# EAGLE design power PCB (EAGLE 7.1.0)
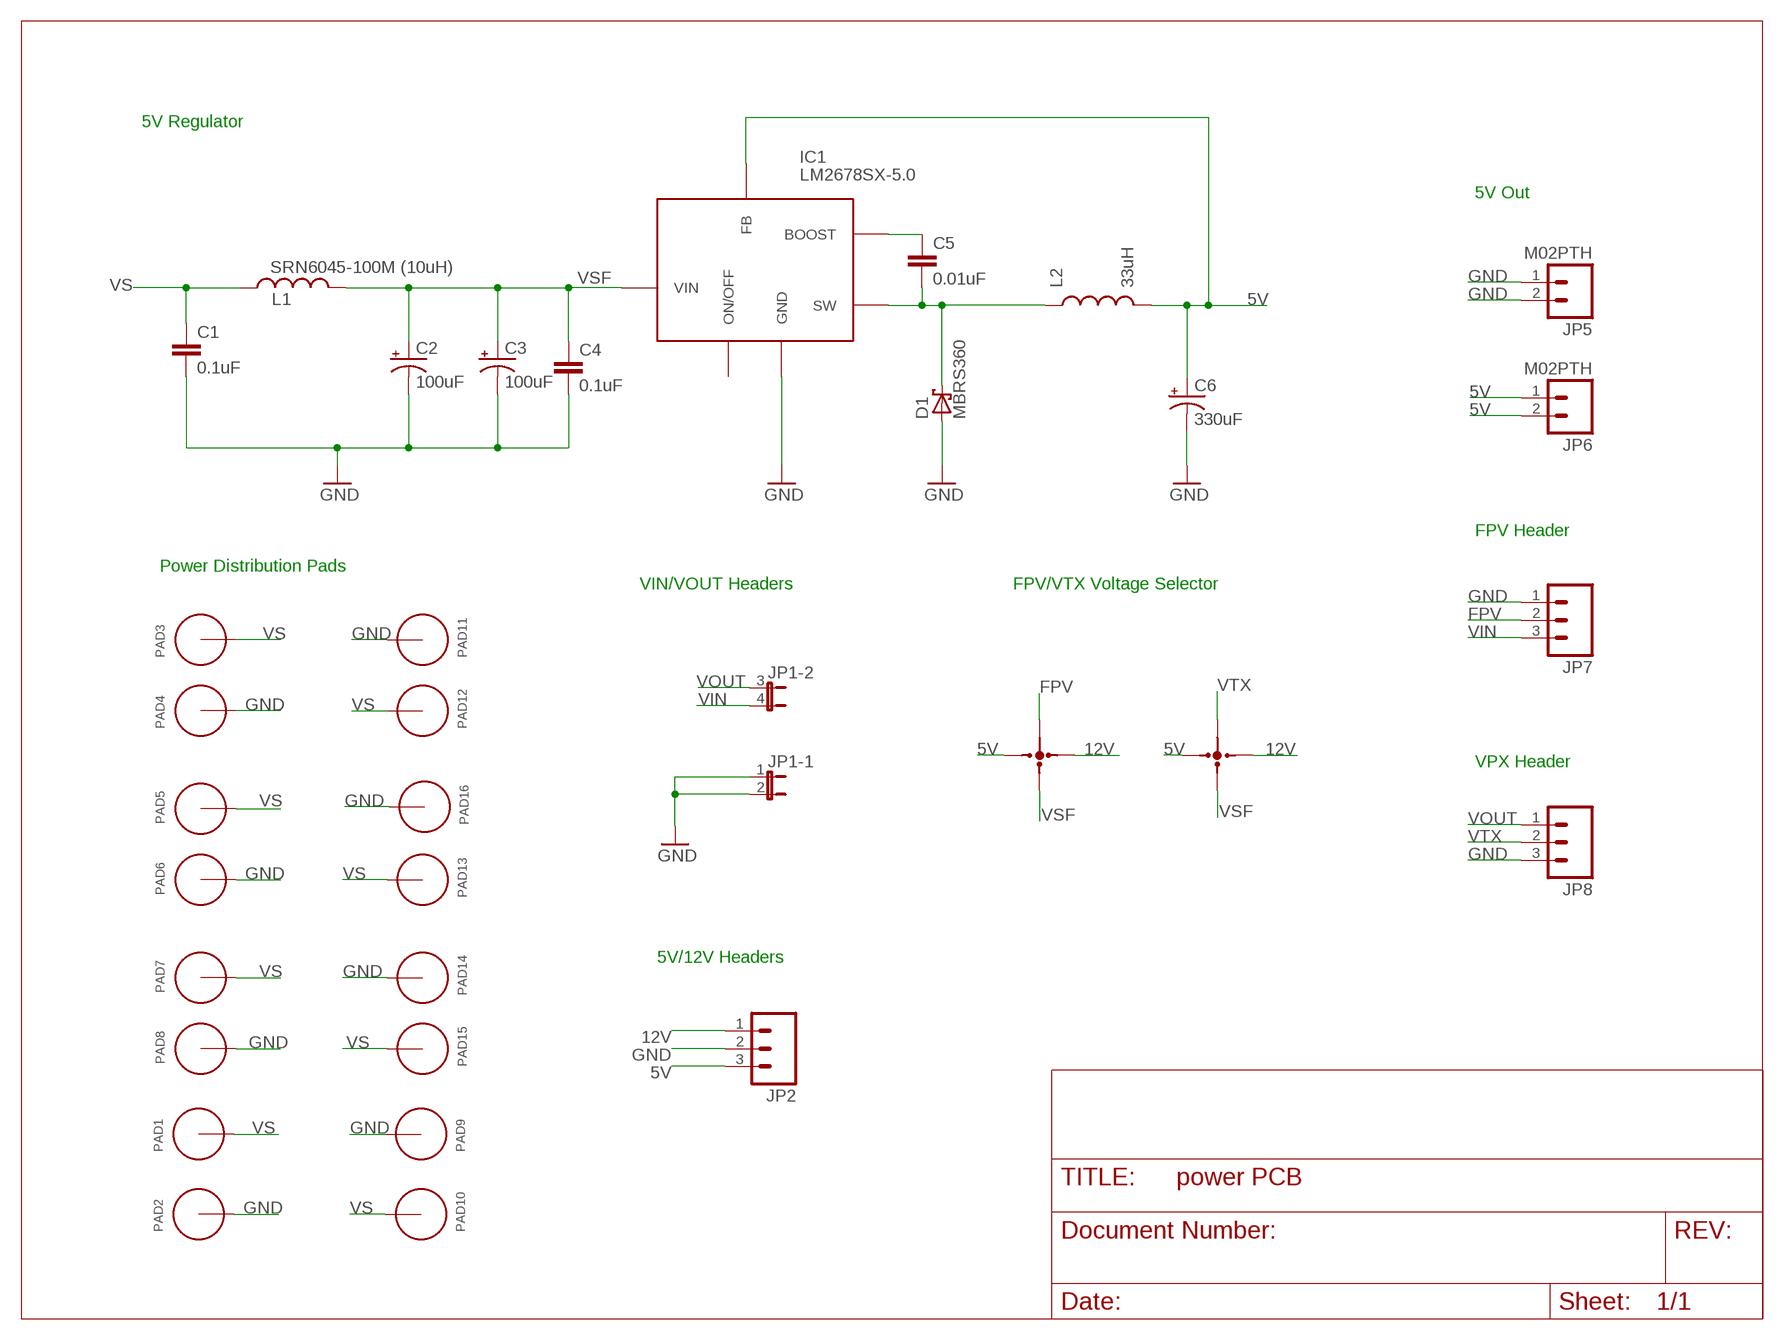
[diagram p0: schematic, sheet 1]

## Parts
C1  0.1uF  0.1UF-25V(+80/-20%)(0603)  [0603-CAP]
C2  100uF  100UF-10V-10%(TANT)  [EIA7343]
C3  100uF  100UF-10V-10%(TANT)  [EIA7343]
C4  0.1uF  0.1UF-25V(+80/-20%)(0603)  [0603-CAP]
C5  0.01uF  0.1UF-25V(+80/-20%)(0603)  [0603-CAP]
C6  330uF  100UF-10V-10%(TANT)  [EIA7343]
D1  MBRS360  MBRS130LT3  [SMB]
IC1  LM2678SX-5.0  LM2678DX-5.0SX-5.0  [P-TO263-7-1]
JP1  JP2QE  [JP2Q]
JP2  M03PTH  [1X03]
JP3  3WAY_SMD_JUMPER  [3WAY_JUMPER]
JP4  3WAY_SMD_JUMPER  [3WAY_JUMPER]
JP5  M02PTH  [1X02]
JP6  M02PTH  [1X02]
JP7  M03PTH  [1X03]
JP8  M03PTH  [1X03]
L1  SRN6045-100M (10uH)  INDUCTORBOURNS_SRN6045  [SRN6045]
L2  33uH  INDUCTORBOURNS_SRN6045  [SRN6045]
PAD1  PAD_3MM  [PAD_3MM]
PAD2  PAD_3MM  [PAD_3MM]
PAD3  PAD_3MM  [PAD_3MM]
PAD4  PAD_3MM  [PAD_3MM]
PAD5  PAD_3MM  [PAD_3MM]
PAD6  PAD_3MM  [PAD_3MM]
PAD7  PAD_3MM  [PAD_3MM]
PAD8  PAD_3MM  [PAD_3MM]
PAD9  PAD_3MM  [PAD_3MM]
PAD10  PAD_3MM  [PAD_3MM]
PAD11  PAD_3MM  [PAD_3MM]
PAD12  PAD_3MM  [PAD_3MM]
PAD13  PAD_3MM  [PAD_3MM]
PAD14  PAD_3MM  [PAD_3MM]
PAD15  PAD_3MM  [PAD_3MM]
PAD16  PAD_3MM  [PAD_3MM]

## Nets
5V: C6.A(+) IC1.6(FB) JP2.3 JP3.1 JP4.3 JP6.1 JP6.2 L2.2
12V: JP2.1 JP3.3 JP4.1
FPV: JP3.4 JP7.2
GND: C1.2 C2.C(-) C3.C(-) C4.2 C6.C(-) D1.A IC1.4(GND) IC1.TH(GND) JP1.1 JP1.2 JP2.2 JP5.1 JP5.2 JP7.1 JP8.3 PAD2.P$1 PAD2.P$2 PAD2.P$3 PAD2.P$4 PAD2.P$5 PAD2.P$6 PAD2.P$7 PAD2.P$8 PAD2.P$9 PAD4.P$1 PAD4.P$2 PAD4.P$3 PAD4.P$4 PAD4.P$5 PAD4.P$6 PAD4.P$7 PAD4.P$8 PAD4.P$9 PAD6.P$1 PAD6.P$2 PAD6.P$3 PAD6.P$4 PAD6.P$5 PAD6.P$6 PAD6.P$7 PAD6.P$8 PAD6.P$9 PAD8.P$1 PAD8.P$2 PAD8.P$3 PAD8.P$4 PAD8.P$5 PAD8.P$6 PAD8.P$7 PAD8.P$8 PAD8.P$9 PAD9.P$1 PAD9.P$2 PAD9.P$3 PAD9.P$4 PAD9.P$5 PAD9.P$6 PAD9.P$7 PAD9.P$8 PAD9.P$9 PAD11.P$1 PAD11.P$2 PAD11.P$3 PAD11.P$4 PAD11.P$5 PAD11.P$6 PAD11.P$7 PAD11.P$8 PAD11.P$9 PAD14.P$1 PAD14.P$2 PAD14.P$3 PAD14.P$4 PAD14.P$5 PAD14.P$6 PAD14.P$7 PAD14.P$8 PAD14.P$9 PAD16.P$1 PAD16.P$2 PAD16.P$3 PAD16.P$4 PAD16.P$5 PAD16.P$6 PAD16.P$7 PAD16.P$8 PAD16.P$9
N$1: C5.1 IC1.3(BOOST)
N$3: C5.2 D1.C IC1.1(SW) L2.1
VIN: JP1.4 JP7.3
VOUT: JP1.3 JP8.1
VS: C1.1 L1.1 PAD1.P$1 PAD1.P$2 PAD1.P$3 PAD1.P$4 PAD1.P$5 PAD1.P$6 PAD1.P$7 PAD1.P$8 PAD1.P$9 PAD3.P$1 PAD3.P$2 PAD3.P$3 PAD3.P$4 PAD3.P$5 PAD3.P$6 PAD3.P$7 PAD3.P$8 PAD3.P$9 PAD5.P$1 PAD5.P$2 PAD5.P$3 PAD5.P$4 PAD5.P$5 PAD5.P$6 PAD5.P$7 PAD5.P$8 PAD5.P$9 PAD7.P$1 PAD7.P$2 PAD7.P$3 PAD7.P$4 PAD7.P$5 PAD7.P$6 PAD7.P$7 PAD7.P$8 PAD7.P$9 PAD10.P$1 PAD10.P$2 PAD10.P$3 PAD10.P$4 PAD10.P$5 PAD10.P$6 PAD10.P$7 PAD10.P$8 PAD10.P$9 PAD12.P$1 PAD12.P$2 PAD12.P$3 PAD12.P$4 PAD12.P$5 PAD12.P$6 PAD12.P$7 PAD12.P$8 PAD12.P$9 PAD13.P$1 PAD13.P$2 PAD13.P$3 PAD13.P$4 PAD13.P$5 PAD13.P$6 PAD13.P$7 PAD13.P$8 PAD13.P$9 PAD15.P$1 PAD15.P$2 PAD15.P$3 PAD15.P$4 PAD15.P$5 PAD15.P$6 PAD15.P$7 PAD15.P$8 PAD15.P$9
VSF: C2.A(+) C3.A(+) C4.1 IC1.2(VIN) JP3.2 JP4.2 L1.2
VTX: JP4.4 JP8.2
Unconnected: IC1.7(ON/OFF)

## Notes on the sheet
- 5V Regulator
- 5V Out
- FPV Header
- Power Distribution Pads
- VIN/VOUT Headers | FPV/VTX Voltage Selector
- VPX Header
- 5V/12V Headers

## Library data of the parts
C1 C4 = SparkFun-Capacitors:0.1UF-25V(+80/-20%)(0603): CAP-00810 Ceramic Standard decoupling cap; PROD_ID: CAP-00810
C2 C3 = Power PCB:100UF-10V-10%(TANT): CAP-07890; PROD_ID: TPSD107K020R0100
C5 = SparkFun-Capacitors:0.1UF-25V(+80/-20%)(0603): CAP-00810 Ceramic Standard decoupling cap; PROD_ID: CAP-00810; VALUE: 0.1uF
C6 = SparkFun-Capacitors:100UF-10V-10%(TANT): CAP-07890; PROD_ID: CAP-07890; VALUE: 100uF
D1 = diode:MBRS130LT3: Schottky Power Rectifier Source: http://www.onsemi.com/pub/Collateral/MBRS130LT3-D.PDF
IC1 = Power PCB:LM2678DX-5.0
JP1 = jumper:JP2QE: JUMPER
JP2 JP7 JP8 = SparkFun-Connectors:M03: Header 3 Standard 3-pin 0.1" header. Use with straight break away headers (SKU : PRT-00116), right angle break away headers (PRT-00553), swiss pins (PRT-00743), machine pins (PRT-00117), and female headers (PRT-00115). Molex polarized connector foot print use with SKU : PRT-08232 with associated crimp pins and housings.
JP3 JP4 = Power PCB:3WAY_SMD_JUMPER
JP5 JP6 = SparkFun-Connectors:M02: Standard 2-pin 0.1" header. Use with - straight break away headers ( PRT-00116) - right angle break away headers (PRT-00553) - swiss pins (PRT-00743) - machine pins (PRT-00117) - female headers (PRT-00115) Molex polarized connector foot print use with: PRT-08233 with associated crimp pins and housings. 2.54_SCREWTERM for use with PRT-10571. 3.5mm Screw Terminal footprints for PRT-08084 5mm Screw Terminal footprints for use with PRT-08432
L1 = SparkFun-Passives:INDUCTOR: Inductors Basic Inductor/Choke - 0603 and 1206. Footprints are not proven and vary greatly between part numbers. SRN6045- 33uH, 20% 1.4A SDR0403-560KL - 56uH, 10%, 500mA RMS/740mA peak; PROD_ID: NDUC-11627; VALUE: 33uH
L2 = SparkFun-Passives:INDUCTOR: Inductors Basic Inductor/Choke - 0603 and 1206. Footprints are not proven and vary greatly between part numbers. SRN6045- 33uH, 20% 1.4A SDR0403-560KL - 56uH, 10%, 500mA RMS/740mA peak; PROD_ID: NDUC-11627
PAD1-PAD16 = Power PCB:PAD_3MM

## Board
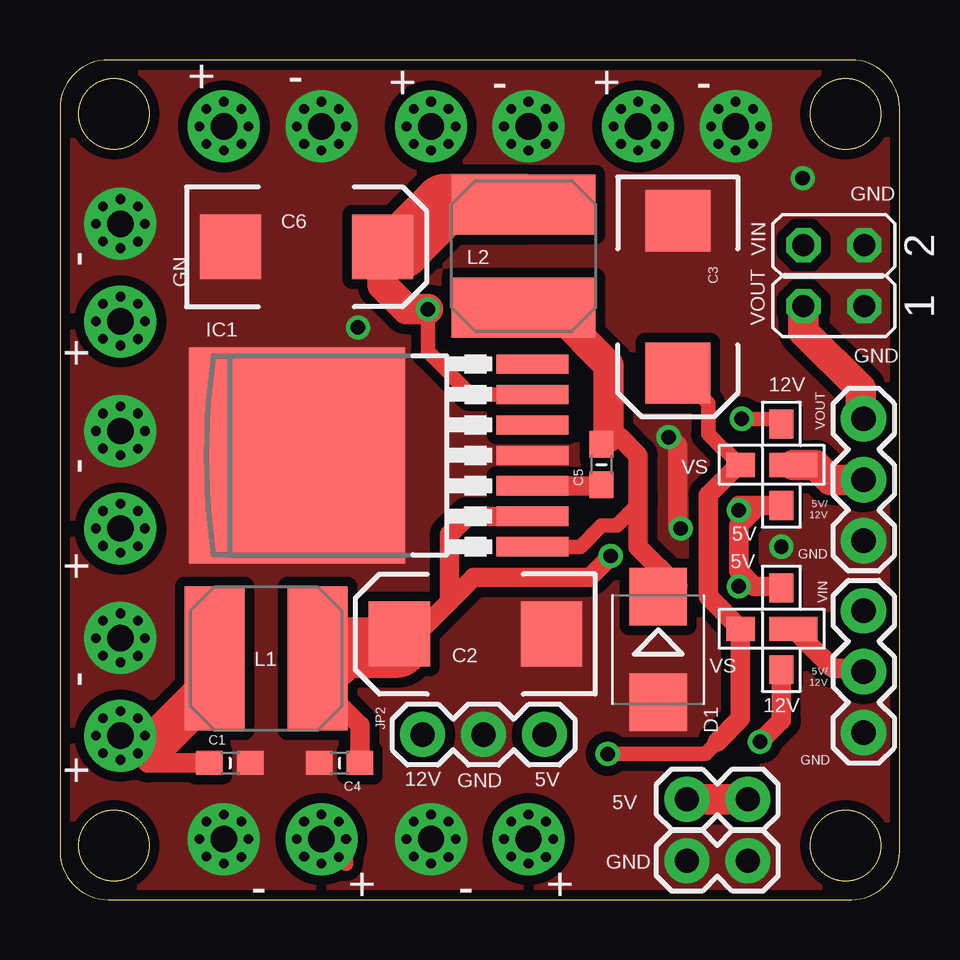
[diagram p1: board, top side]
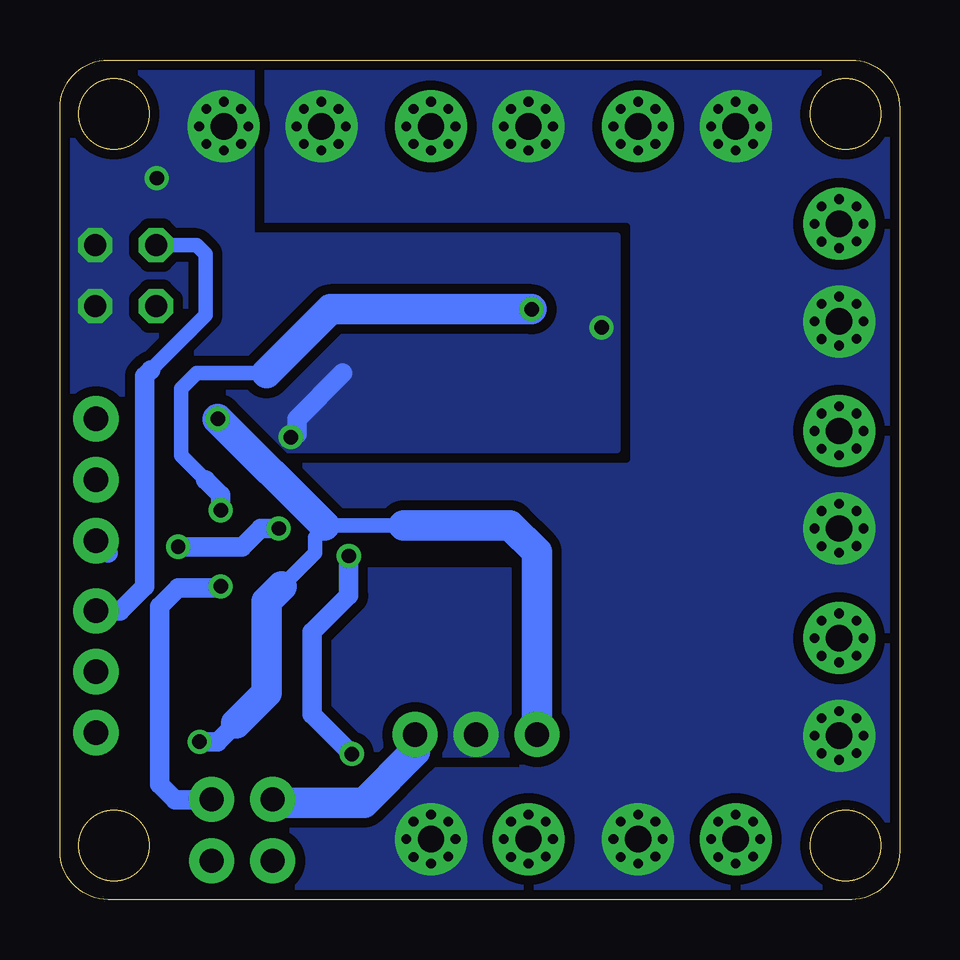
[diagram p2: board, bottom side, seen from below]

Size 35 x 35 mm. Coordinates in mm from the lower left corner, seen from the top.
Outline: 35,2 35,33 arc90 33,35 2,35 arc90 0,33 0,2 arc90 2,0 33,0 arc90 35,2
Outline: circle at 2.25,2.25 radius 1.48
Outline: circle at 32.75,32.75 radius 1.48
Outline: circle at 2.25,32.75 radius 1.48
Outline: circle at 32.75,2.25 radius 1.48
Copper layers (1*16): Top 0.035mm / dielectric 1.5mm / Bottom 0.035mm
Design rules "default *": minimum track width 10mil, minimum drill 10mil, track to track 8mil, track to pad 8mil, pad to pad 8mil, via to via 8mil, smd to smd 8mil, copper to edge 16mil, drill to drill 8mil, minimum pad ring 10mil, minimum via ring 8mil, stop-mask expansion 4mil, vias tented up to drill 0mil, thermal gap 10mil

### Footprints (pad centres in the part's own frame; a part is rotated, then mirrored left to right if it is on the bottom)
0603-CAP = smd 1.1 x 1: 1 -0.85,0; 2 0.85,0
EIA7343 = smd 2.55 x 2.7: A 3.17,0; C -3.17,0
SMB = smd 2.4 x 2.4: A 2.2,0; C -2.2,0
P-TO263-7-1 = smd 0.8 x 3: 1 -3.81,-3.475; 2 -2.54,-3.475; 3 -1.27,-3.475; 4 0,-3.475; 5 1.27,-3.475; 6 2.54,-3.475; 7 3.81,-3.475 | smd 9 x 9: TH 0,6.35
JP2Q = drill 0.914 octagon: 1 -1.27,-1.27; 2 1.27,-1.27; 3 -1.27,1.27; 4 1.27,1.27
1X03 = drill 1.016 pad 1.88: 1 0,0; 2 2.54,0; 3 5.08,0
3WAY_JUMPER = smd 1.2 x 1: 1 -1.7,0; 3 1.7,0 | smd 1 x 1.2: 2 0,-1.7 | smd 1 x 2: 4 0,0.5
1X02 = drill 1.016 pad 1.88: 1 0,0; 2 2.54,0
SRN6045 = smd 2.5 x 6: 1 -2.175,-0.175; 2 2.125,-0.175
PAD_3MM = drill 1.1 pad 3: P$1 0,0 | drill 0.4 pad 0.45: P$2 -1.02,0; P$3 -0.72,-0.73; P$4 0,-1.01; P$5 0.73,-0.74; P$6 1.03,0; P$7 0.73,0.73; P$8 0,1.03; P$9 -0.72,0.73

### Placement (x,y rotation side)
C1  7.09,5.69 0 top
C2  17.31,11.07 180 top
C3  25.75,25.12 270 top
C4  11.66,5.69 180 top
C5  22.58,18.13 90 top
C6  10.28,27.21 0 top
D1  24.94,10.43 270 top
IC1  16.23,18.52 90 top
JP1  32.27,26.01 90 top
JP2  15.12,6.88 0 top
JP3  30.07,11.29 270 top
JP4  30.07,18.12 270 top
JP5  28.68,1.61 180 top
JP6  28.68,4.17 180 top
JP7  33.5,6.96 90 top
JP8  33.5,20.04 270 top
L1  8.62,10.22 0 top
L2  19.15,26.85 90 top
PAD1  2.51,24.1 0 top
PAD2  2.51,28.17 0 top
PAD3  2.51,6.83 0 top
PAD4  2.51,10.9 0 top
PAD5  15.47,32.23 0 top
PAD6  19.53,32.23 0 top
PAD7  6.83,32.23 0 top
PAD8  10.9,32.23 0 top
PAD9  28.17,32.23 0 top
PAD10  24.1,32.23 0 top
PAD11  15.47,2.51 0 top
PAD12  19.53,2.51 0 top
PAD13  2.51,15.47 0 top
PAD14  6.83,2.51 0 top
PAD15  10.9,2.51 0 top
PAD16  2.51,19.53 0 top

### Tracks (layer width: path | path; a pad name or v marks a point on that pad's centre or on a via)
5V  (via drill 0.6)
  Top 0.61: IC1.6 17.12,21.06 15.34,22.83 v15.34,24.61 | v28.29,13.06 v28.29,16.23
  Top 0.813: JP4.3 29.12,16.42 | 29.12,16.42 28.29,15.6 28.29,13.69 28.93,13.06 30,13.06 JP3.1 | 29.12,16.42 28.29,16.42 v28.29,16.23
  Top 1.27: C6.A 13.45,25.61 14.45,24.61 v15.34,24.61 | JP6.2 JP6.1
  Top 2.54: L2.2 16.02,28.97 14.2,27.15 13.51,27.15 C6.A
  Bottom 0.61: 28.93,17.5 29.95,18.52 29.95,21.31 29.31,21.95 26.39,21.95
  Bottom 0.813: JP6.1 28.69,4.17 30.2,4.17 30.83,4.8 30.83,12.23 JP3.1 28.36,12.99 v28.29,13.06 | 28.93,17.5 28.29,16.86 v28.29,16.23
  Bottom 1.27: JP6.2 26,4.04 22.33,4.04 20.2,6.17 JP2.3 | v15.34,24.61 23.72,24.61 26.39,21.95
12V  (via drill 0.6)
  Top 0.61: v28.42,20.04 29.86,20.04 JP4.1
  Top 0.813: v29.18,6.58 30.07,7.47 JP3.3
  Bottom 0.61: 20.67,15.6 23.98,15.6 23.98,15.47 24.36,15.09 24.36,14.45 25.75,13.06
  Bottom 0.813: 27.66,7.34 28.42,6.58 v29.18,6.58
  Bottom 1.27: 27.66,7.34 26.39,8.61 26.39,12.42 25.75,13.06 | JP2.1 15.12,14.48 16.23,15.6 20.67,15.6 | v28.42,20.04 23.98,15.6
FPV
  Top 0.813: JP3.4 31.21,10.65 32.23,9.63 33.38,9.63 JP7.2
GND  (via drill 0.6)
  Top 0.813: v25.88,15.47 25.75,15.6 25.75,18.9 v25.37,19.28
  Bottom 0.813: JP8.3 32.99,14.45 | v25.88,15.47 26.64,15.47 27.41,14.71 v30.07,14.71 | v25.37,19.28 25.25,19.28 25.12,19.4 25.12,20.04 23.21,21.95
  other vias: 12.42,23.85 30.96,30.07
  pour Top (isolate 0.406, no thermals): -0.03,35.03 35.03,35.03 35.03,-0.03 -0.03,-0.03
  pour Bottom (isolate 0.406, no thermals, hatched): 11.79,27.66 11.79,18.77 34.64,18.77 34.64,27.66
  pour Bottom (isolate 0.406, no thermals, hatched): 16.23,13.69 27.02,13.69 27.02,6.07 16.23,6.07
  pour Bottom (isolate 0.406, no thermals, hatched): 27.02,34.77 27.02,26.39 34.52,26.39 34.52,34.77
N$1
  Top 0.813: IC1.3 22.54,17.25 C5.1
N$3
  Top 0.61: IC1.1 21.69,14.71 22.58,15.6 23.21,15.6 24.1,16.48
  Top 0.813: 24.1,16.48 24.1,16.86 | 24.1,16.86 24.1,18.52 23.34,19.28 22.87,19.28 C5.2 | D1.C 25.37,13.06 25.75,13.06 24.1,14.71 24.1,16.86
  Top 1.27: 22.87,19.28 22.87,22.29 20.67,24.48 19.52,24.48 L2.1
VIN
  Bottom 0.61: 31.22,22.07 28.93,24.36 28.93,26.9 29.31,27.28 JP1.4
  Bottom 0.813: 31.22,22.07 31.47,21.82 31.47,13.06 32.49,12.04 JP7.3
VOUT
  Top 1.27: JP1.3 31,23.69 33.38,21.31 33.38,20.13 JP8.1
VS
  Top 0.61: PAD15.P$6 11.93,1.48
  Top 0.813: C1.1 3.66,5.69 PAD3.P$1
  Top 1.778: L1.1 6.44,8.99 4.04,6.58 2.77,6.58 PAD3.P$1
  pour Bottom (isolate 0.406, rank 2, no thermals): -0.03,35.03 35.03,35.03 35.03,31.98 35.03,-0.03 -0.03,-0.03
VSF  (via drill 0.6)
  Top 0.61: 27.41,6.58 26.9,6.07 v22.83,6.07 | 16.23,12.52 16.23,12.42 | 14.96,10.64 14.96,11.15 14.88,11.07 C2.A | C3.A 27.02,20.67 27.02,19.4 27.66,18.77 27.73,18.77 JP4.2
  Top 0.813: C4.1 12.51,7.25 11.32,8.44 11.32,10.05 | 16.23,12.52 16.23,15.21 16.99,15.98 IC1.2 | 27.41,6.58 28.37,7.54 JP3.2 27.02,12.63 27.02,16.86 28.29,18.12 JP4.2 | 14.96,11.15 16.23,12.42 17.25,13.44 22.07,13.44 v22.96,14.33
  Top 2.54: L1.2 11.32,10.05 11.79,10.52 14.06,10.52 C2.A
  Bottom 0.813: v22.83,6.07 24.48,7.72 24.48,11.15 22.96,12.67 v22.96,14.33
VTX
  Top 1.27: JP4.4 31.48,18.12 32.1,17.5 JP8.2

### Text on the board
tPlace: + | - | + | - | + | - | GND | - | GN | VIN | VOUT | GND | + | 12V | VOUT | VS | - | 5V/ / 12V | 5V | GND | + | 5V | VIN | VS | 5V/ / 12V | - | 12V | 12V | GND | 5V | GND | + | 5V | - | + | - | + | GND